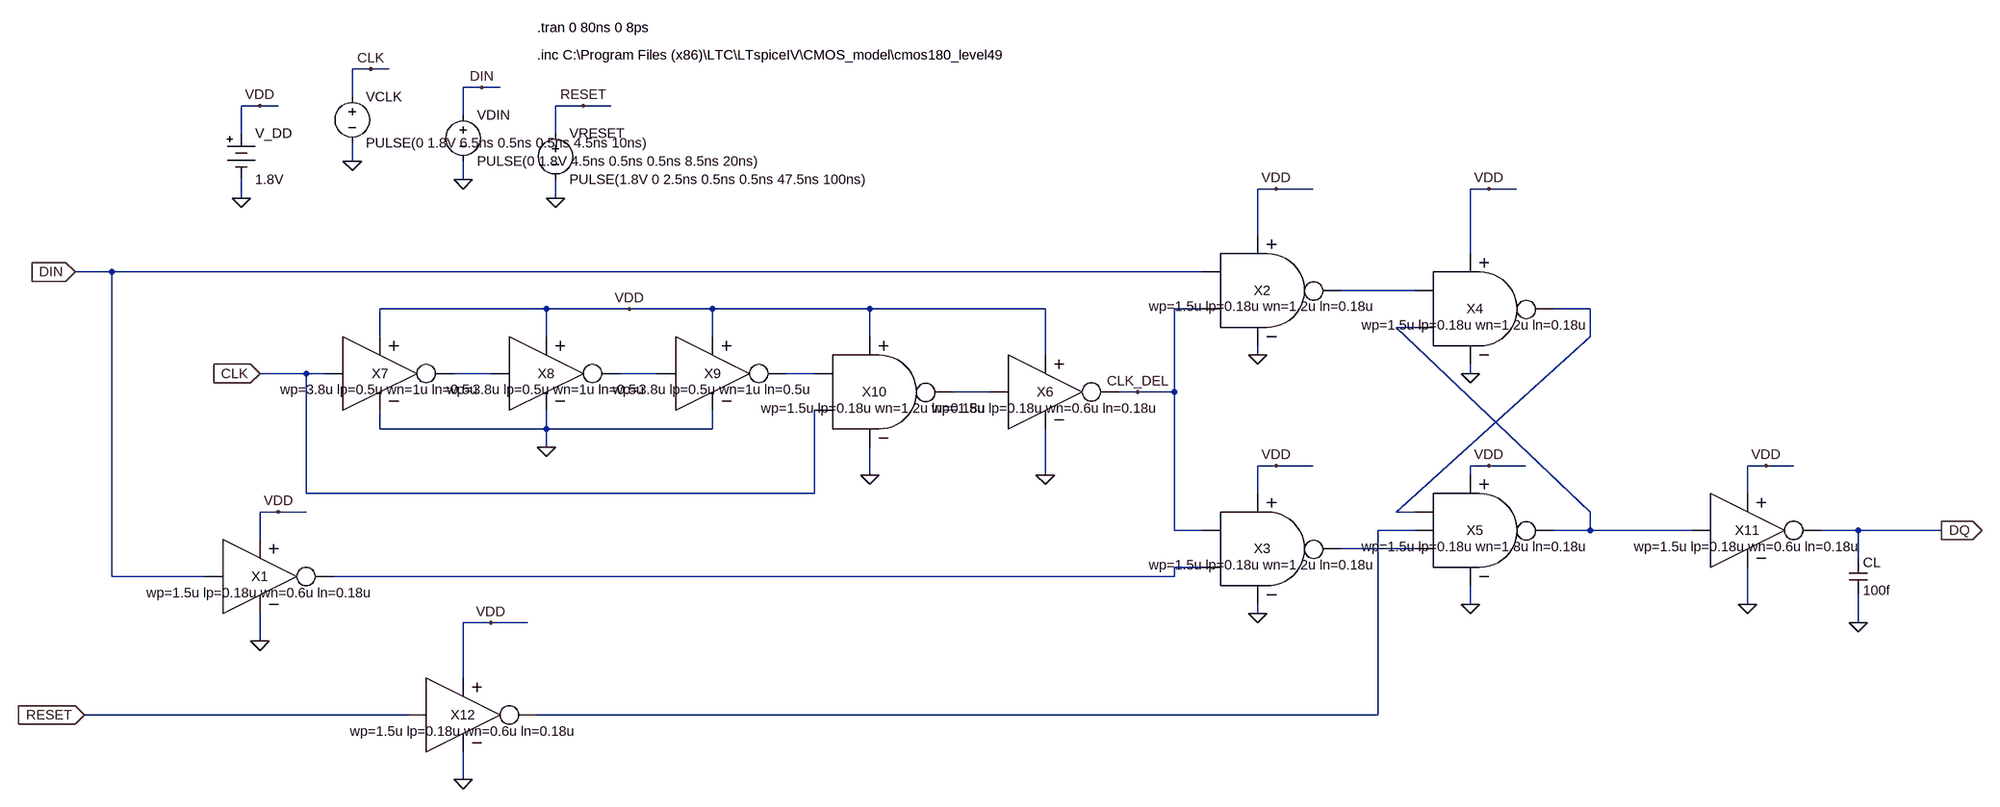
[diagram p0: schematic lab3.asc]
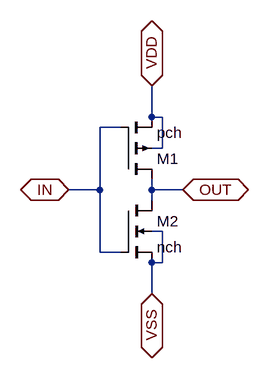
[diagram p1: sub-circuit inv.asc]
lab3.asc, the LTspice schematic file:
Version 4
SHEET 1 2796 900
WIRE -112 -352 -144 -352
WIRE -80 -352 -112 -352
WIRE 80 -320 48 -320
WIRE 112 -320 80 -320
WIRE -144 -304 -144 -352
WIRE -304 -288 -336 -288
WIRE -272 -288 -304 -288
WIRE 256 -288 208 -288
WIRE 304 -288 256 -288
WIRE 48 -272 48 -320
WIRE -336 -240 -336 -288
WIRE 208 -240 208 -288
WIRE -144 -192 -144 -224
WIRE 48 -160 48 -192
WIRE 1456 -144 1424 -144
WIRE 1520 -144 1456 -144
WIRE 1824 -144 1792 -144
WIRE 1872 -144 1824 -144
WIRE -336 -128 -336 -160
WIRE 208 -128 208 -160
WIRE 1424 -64 1424 -144
WIRE 1792 -32 1792 -144
WIRE -560 0 -624 0
WIRE 1328 0 -560 0
WIRE 1696 32 1568 32
WIRE 192 64 -96 64
WIRE 336 64 192 64
WIRE 480 64 336 64
WIRE 752 64 480 64
WIRE 1056 64 752 64
WIRE 1328 64 1280 64
WIRE 2000 64 1936 64
WIRE 1696 96 1664 96
WIRE -96 112 -96 64
WIRE 192 112 192 64
WIRE 480 112 480 64
WIRE 752 112 752 64
WIRE 2000 112 2000 64
WIRE 1056 144 1056 64
WIRE 1424 144 1424 128
WIRE -224 176 -304 176
WIRE -192 176 -224 176
WIRE 96 176 32 176
WIRE 384 176 320 176
WIRE 656 176 608 176
WIRE 1792 176 1792 160
WIRE 960 208 896 208
WIRE 1216 208 1184 208
WIRE 1280 208 1280 64
WIRE 1280 208 1216 208
WIRE -96 272 -96 240
WIRE 192 272 192 240
WIRE 192 272 -96 272
WIRE 480 272 480 240
WIRE 480 272 192 272
WIRE 192 304 192 272
WIRE 1456 336 1424 336
WIRE 1520 336 1456 336
WIRE 1824 336 1792 336
WIRE 1888 336 1824 336
WIRE 2304 336 2272 336
WIRE 2352 336 2304 336
WIRE 752 352 752 304
WIRE 1056 352 1056 272
WIRE 1792 352 1792 336
WIRE -224 384 -224 176
WIRE 656 384 656 240
WIRE 656 384 -224 384
WIRE 1424 384 1424 336
WIRE 2272 384 2272 336
WIRE -272 416 -304 416
WIRE -224 416 -272 416
WIRE 1664 416 2000 112
WIRE 1696 416 1664 416
WIRE 2000 416 1664 96
WIRE 1280 448 1280 208
WIRE 1328 448 1280 448
WIRE 1696 448 1632 448
WIRE 2000 448 2000 416
WIRE 2000 448 1936 448
WIRE 2176 448 2000 448
WIRE 2464 448 2400 448
WIRE 2608 448 2464 448
WIRE -304 464 -304 416
WIRE 1696 480 1568 480
WIRE 2464 496 2464 448
WIRE 1328 512 1280 512
WIRE -560 528 -560 0
WIRE -400 528 -560 528
WIRE 1280 528 1280 512
WIRE 1280 528 -176 528
WIRE 1792 576 1792 544
WIRE 2272 576 2272 512
WIRE 1424 592 1424 576
WIRE 96 608 48 608
WIRE 160 608 96 608
WIRE 2464 608 2464 560
WIRE -304 640 -304 592
WIRE 48 704 48 608
WIRE -48 768 -608 768
WIRE 1632 768 1632 448
WIRE 1632 768 176 768
WIRE 48 880 48 832
FLAG -304 176 CLK
IOPIN -304 176 In
FLAG 192 304 0
FLAG 752 352 0
FLAG -336 -128 0
FLAG -144 -192 0
FLAG 1056 352 0
FLAG -624 0 DIN
IOPIN -624 0 In
FLAG 2608 448 DQ
IOPIN 2608 448 Out
FLAG 2464 608 0
FLAG 1792 176 0
FLAG -304 -288 VDD
FLAG 336 64 VDD
FLAG -272 416 VDD
FLAG 48 -160 0
FLAG 208 -128 0
FLAG -112 -352 CLK
FLAG 80 -320 DIN
FLAG 256 -288 RESET
FLAG -304 640 0
FLAG -608 768 RESET
IOPIN -608 768 In
FLAG 1424 144 0
FLAG 1424 592 0
FLAG 1456 -144 VDD
FLAG 1456 336 VDD
FLAG 1824 -144 VDD
FLAG 1824 336 VDD
FLAG 1792 576 0
FLAG 2272 576 0
FLAG 2304 336 VDD
FLAG 48 880 0
FLAG 96 608 VDD
FLAG 1216 208 CLK_DEL
SYMBOL inv -96 176 R0
WINDOW 39 0 28 Center 2
SYMATTR SpiceLine wp=3.8u lp=0.5u wn=1u ln=0.5u
SYMATTR InstName X7
SYMBOL inv 192 176 R0
WINDOW 39 0 28 Center 2
SYMATTR SpiceLine wp=3.8u lp=0.5u wn=1u ln=0.5u
SYMATTR InstName X8
SYMBOL inv 480 176 R0
WINDOW 39 0 28 Center 2
SYMATTR SpiceLine wp=3.8u lp=0.5u wn=1u ln=0.5u
SYMATTR InstName X9
SYMBOL inv 1056 208 R0
WINDOW 39 0 28 Center 2
SYMATTR SpiceLine wp=1.5u lp=0.18u wn=0.6u ln=0.18u
SYMATTR InstName X6
SYMBOL nand2 768 208 R0
WINDOW 39 -8 28 Center 2
SYMATTR SpiceLine wp=1.5u lp=0.18u wn=1.2u ln=0.18u
SYMATTR InstName X10
SYMBOL Misc\\battery -336 -256 R0
SYMATTR InstName V_DD
SYMATTR Value 1.8V
SYMBOL voltage -144 -320 R0
WINDOW 123 0 0 Left 2
WINDOW 39 0 0 Left 2
SYMATTR InstName VCLK
SYMATTR Value PULSE(0 1.8V 6.5ns 0.5ns 0.5ns 4.5ns 10ns)
SYMBOL nand2 1440 32 R0
WINDOW 39 -8 28 Center 2
SYMATTR SpiceLine wp=1.5u lp=0.18u wn=1.2u ln=0.18u
SYMATTR InstName X2
SYMBOL inv 2272 448 R0
WINDOW 39 0 28 Center 2
SYMATTR SpiceLine wp=1.5u lp=0.18u wn=0.6u ln=0.18u
SYMATTR InstName X11
SYMBOL inv -304 528 R0
WINDOW 39 0 28 Center 2
SYMATTR SpiceLine wp=1.5u lp=0.18u wn=0.6u ln=0.18u
SYMATTR InstName X1
SYMBOL nand2 1440 480 R0
WINDOW 39 -8 28 Center 2
SYMATTR SpiceLine wp=1.5u lp=0.18u wn=1.2u ln=0.18u
SYMATTR InstName X3
SYMBOL nand2 1808 64 R0
WINDOW 39 -8 28 Center 2
SYMATTR SpiceLine wp=1.5u lp=0.18u wn=1.2u ln=0.18u
SYMATTR InstName X4
SYMBOL nand3 1808 448 R0
WINDOW 39 -8 28 Center 2
SYMATTR SpiceLine wp=1.5u lp=0.18u wn=1.8u ln=0.18u
SYMATTR InstName X5
SYMBOL cap 2448 496 R0
SYMATTR InstName CL
SYMATTR Value 100f
SYMBOL voltage 48 -288 R0
WINDOW 123 0 0 Left 2
WINDOW 39 0 0 Left 2
SYMATTR InstName VDIN
SYMATTR Value PULSE(0 1.8V 4.5ns 0.5ns 0.5ns 8.5ns 20ns)
SYMBOL voltage 208 -256 R0
WINDOW 123 0 0 Left 2
WINDOW 39 0 0 Left 2
SYMATTR InstName VRESET
SYMATTR Value PULSE(1.8V 0 2.5ns 0.5ns 0.5ns 47.5ns 100ns)
SYMBOL inv 48 768 R0
WINDOW 39 0 28 Center 2
SYMATTR SpiceLine wp=1.5u lp=0.18u wn=0.6u ln=0.18u
SYMATTR InstName X12
TEXT 176 -376 Left 2 !.inc C:\\Program Files (x86)\\LTC\\LTspiceIV\\CMOS_model\\cmos180_level49
TEXT 176 -424 Left 2 !.tran 0 80ns 0 8ps

inv.asc, the sub-circuit schematic file:
Version 4
SHEET 1 880 680
WIRE 240 32 240 -16
WIRE 256 32 240 32
WIRE 192 48 160 48
WIRE 256 80 256 32
WIRE 256 80 240 80
WIRE 160 144 160 48
WIRE 160 144 112 144
WIRE 240 144 240 128
WIRE 288 144 240 144
WIRE 240 160 240 144
WIRE 256 208 240 208
WIRE 160 240 160 144
WIRE 192 240 160 240
WIRE 256 256 256 208
WIRE 256 256 240 256
WIRE 240 304 240 256
FLAG 112 144 IN
IOPIN 112 144 BiDir
FLAG 288 144 OUT
IOPIN 288 144 BiDir
FLAG 240 -16 VDD
IOPIN 240 -16 BiDir
FLAG 240 304 VSS
IOPIN 240 304 BiDir
SYMBOL pmos4 192 128 M180
SYMATTR InstName M1
SYMATTR Value pch
SYMATTR Value2 l=lp w=wp
SYMBOL nmos4 192 160 R0
SYMATTR InstName M2
SYMATTR Value nch
SYMATTR Value2 l=ln w=wn

The netlist it stands for:
* lab3.asc
XX7 CLK N004 VDD 0 inv params: wp=3.8u lp=0.5u wn=1u ln=0.5u
XX8 N004 N005 VDD 0 inv params: wp=3.8u lp=0.5u wn=1u ln=0.5u
XX9 N005 N006 VDD 0 inv params: wp=3.8u lp=0.5u wn=1u ln=0.5u
XX6 N007 CLK_DEL VDD 0 inv params: wp=1.5u lp=0.18u wn=0.6u ln=0.18u
XX10 N006 CLK N007 VDD 0 nand2 params: wp=1.5u lp=0.18u wn=1.2u ln=0.18u  ; pins A B Y VDD VSS
V_DD VDD 0 1.8V
VCLK CLK 0 PULSE(0 1.8V 6.5ns 0.5ns 0.5ns 4.5ns 10ns)
XX2 DIN CLK_DEL N001 VDD 0 nand2 params: wp=1.5u lp=0.18u wn=1.2u ln=0.18u  ; pins A B Y VDD VSS
XX11 N003 DQ VDD 0 inv params: wp=1.5u lp=0.18u wn=0.6u ln=0.18u
XX1 DIN N010 VDD 0 inv params: wp=1.5u lp=0.18u wn=0.6u ln=0.18u
XX3 CLK_DEL N010 N009 VDD 0 nand2 params: wp=1.5u lp=0.18u wn=1.2u ln=0.18u  ; pins A B Y VDD VSS
XX4 N001 N003 N002 VDD 0 nand2 params: wp=1.5u lp=0.18u wn=1.2u ln=0.18u  ; pins A B Y VDD VSS
XX5 N002 N009 N003 N008 VDD 0 nand3 params: wp=1.5u lp=0.18u wn=1.8u ln=0.18u  ; pins A C Y B VDD VSS
CL DQ 0 100f
VDIN DIN 0 PULSE(0 1.8V 4.5ns 0.5ns 0.5ns 8.5ns 20ns)
VRESET RESET 0 PULSE(1.8V 0 2.5ns 0.5ns 0.5ns 47.5ns 100ns)
XX12 RESET N008 VDD 0 inv params: wp=1.5u lp=0.18u wn=0.6u ln=0.18u

* block symbol definitions
.subckt inv IN OUT VDD VSS
M1 OUT IN VDD VDD pch l=lp w=wp
M2 OUT IN VSS VSS nch l=ln w=wn
.ends inv

.model NMOS NMOS
.model PMOS PMOS
.lib standard.mos
.inc C:\Program Files (x86)\LTC\LTspiceIV\CMOS_model\cmos180_level49
.tran 0 80ns 0 8ps
.backanno
.end

* Results of the author's LTspice run, read from the files saved beside the schematic
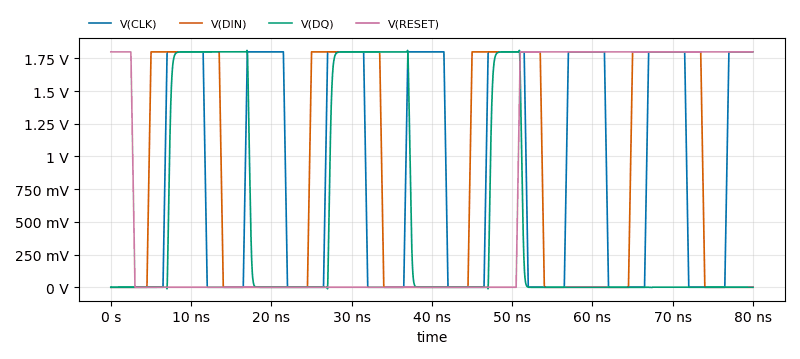
[diagram p2: Transient Analysis of lab3.asc, plotted from the saved traces]
* Transient Analysis, 1 run:
*   V(CLK): min 0 V, max 1.8 V, average 860.6 mV, rms 1.224 V, last 1.8 V
*   V(DIN): min 0 V, max 1.8 V, average 810 mV, rms 1.196 V, last 0 V
*   V(DQ): min -11.84 mV, max 1.812 V, average 537.8 mV, rms 970 mV, last 0 V
*   V(RESET): min 0 V, max 1.8 V, average 720 mV, rms 1.135 V, last 1.8 V